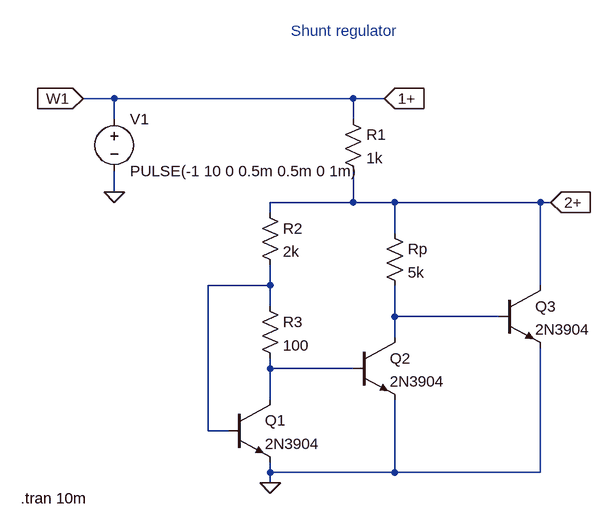
[diagram p0: schematic shunt_reg.asc]
shunt_reg.asc, the LTspice schematic file:
Version 4
SHEET 1 880 792
WIRE -240 160 -288 160
WIRE 128 160 -240 160
WIRE 176 160 128 160
WIRE -240 192 -240 160
WIRE 128 192 128 160
WIRE -240 304 -240 272
WIRE 128 320 128 272
WIRE 128 320 0 320
WIRE 192 320 128 320
WIRE 416 320 192 320
WIRE 432 320 416 320
WIRE 0 336 0 320
WIRE 192 368 192 320
WIRE 0 448 0 416
WIRE 0 448 -96 448
WIRE 416 448 416 320
WIRE 0 480 0 448
WIRE 192 496 192 448
WIRE 352 496 192 496
WIRE 192 528 192 496
WIRE 0 576 0 560
WIRE 128 576 0 576
WIRE 0 624 0 576
WIRE -96 672 -96 448
WIRE -64 672 -96 672
WIRE 0 736 0 720
WIRE 192 736 192 624
WIRE 192 736 0 736
WIRE 416 736 416 544
WIRE 416 736 192 736
WIRE 0 752 0 736
FLAG 0 752 0
FLAG -240 304 0
FLAG 176 160 1+
IOPIN 176 160 In
FLAG -288 160 W1
IOPIN -288 160 In
FLAG 432 320 2+
IOPIN 432 320 In
SYMBOL res 112 176 R0
SYMATTR InstName R1
SYMATTR Value 1k
SYMBOL res -16 320 R0
SYMATTR InstName R2
SYMATTR Value 2k
SYMBOL res -16 464 R0
SYMATTR InstName R3
SYMATTR Value 100
SYMBOL res 176 352 R0
SYMATTR InstName Rp
SYMATTR Value 5k
SYMBOL npn -64 624 R0
SYMATTR InstName Q1
SYMATTR Value 2N3904
SYMBOL npn 128 528 R0
SYMATTR InstName Q2
SYMATTR Value 2N3904
SYMBOL npn 352 448 R0
SYMATTR InstName Q3
SYMATTR Value 2N3904
SYMBOL voltage -240 176 R0
WINDOW 123 0 0 Left 0
WINDOW 39 0 0 Left 0
SYMATTR InstName V1
SYMATTR Value PULSE(-1 10 0 0.5m 0.5m 0 1m)
TEXT -384 776 Left 2 !.tran 10m
TEXT 32 56 Left 2 ;Shunt regulator

The netlist it stands for:
* shunt_reg.asc
R1 W1 2+ 1k
R2 2+ N001 2k
R3 N001 N003 100
Rp 2+ N002 5k
Q1 N003 N001 0 0 2N3904
Q2 N002 N003 0 0 2N3904
Q3 2+ N002 0 0 2N3904
V1 W1 0 PULSE(-1 10 0 0.5m 0.5m 0 1m)
.model NPN NPN
.model PNP PNP
.lib standard.bjt
.tran 10m
* Shunt regulator
.backanno
.end